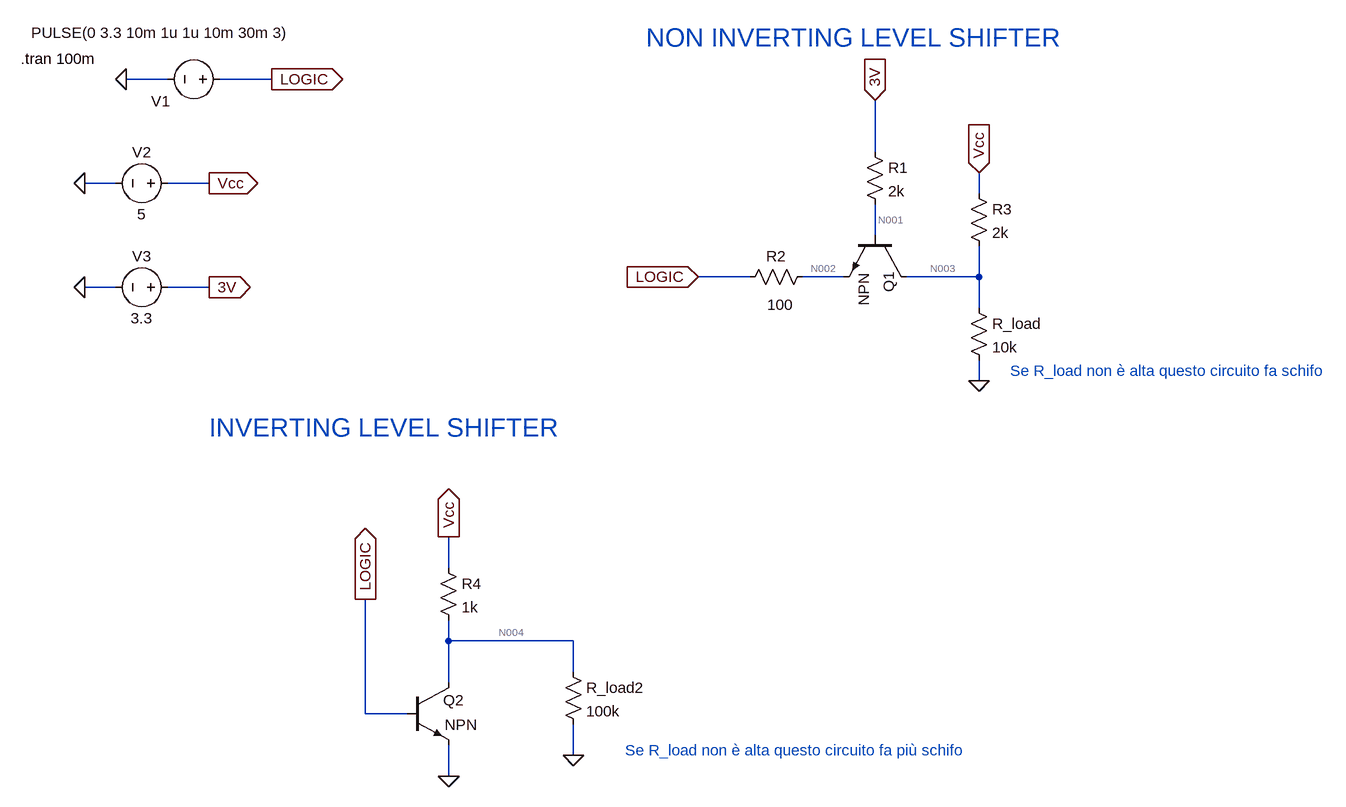
[diagram p0: schematic level_shifter_3.3to5.asc]
level_shifter_3.3to5.asc, the LTspice schematic file:
Version 4
SHEET 1 1340 1076
WIRE -480 -16 -544 -16
WIRE -320 -16 -400 -16
WIRE 608 96 608 16
WIRE -560 144 -608 144
WIRE -416 144 -480 144
WIRE 768 160 768 128
WIRE 608 224 608 176
WIRE 416 288 336 288
WIRE 560 288 496 288
WIRE 768 288 768 240
WIRE 768 288 656 288
WIRE -560 304 -608 304
WIRE -416 304 -480 304
WIRE 768 336 768 288
WIRE 768 448 768 416
WIRE -48 736 -48 688
WIRE -48 848 -48 816
WIRE 144 848 -48 848
WIRE 144 896 144 848
WIRE -48 912 -48 848
WIRE -176 960 -176 784
WIRE -112 960 -176 960
WIRE 144 1024 144 976
WIRE -48 1056 -48 1008
FLAG -544 -16 0
FLAG -608 144 0
FLAG -608 304 0
FLAG 768 448 0
FLAG -416 144 Vcc
IOPIN -416 144 Out
FLAG -416 304 3V
IOPIN -416 304 Out
FLAG -320 -16 LOGIC
IOPIN -320 -16 Out
FLAG 768 128 Vcc
IOPIN 768 128 In
FLAG 608 16 3V
IOPIN 608 16 In
FLAG 336 288 LOGIC
IOPIN 336 288 In
FLAG -48 1056 0
FLAG -176 784 LOGIC
IOPIN -176 784 Out
FLAG -48 688 Vcc
IOPIN -48 688 Out
FLAG 144 1024 0
SYMBOL res 592 80 R0
SYMATTR InstName R1
SYMATTR Value 2k
SYMBOL npn 656 224 R90
WINDOW 0 56 27 Left 2
WINDOW 3 58 65 Left 2
SYMATTR InstName Q1
SYMBOL voltage -384 -16 R90
WINDOW 0 34 92 VRight 2
WINDOW 3 -72 -92 VRight 2
WINDOW 123 0 0 Left 0
WINDOW 39 0 0 Left 0
SYMATTR InstName V1
SYMATTR Value PULSE(0 3.3 10m 1u 1u 10m 30m 3)
SYMBOL voltage -464 144 R90
WINDOW 0 -32 56 VBottom 2
WINDOW 3 32 56 VTop 2
WINDOW 123 0 0 Left 0
WINDOW 39 0 0 Left 0
SYMATTR InstName V2
SYMATTR Value 5
SYMBOL res 752 144 R0
SYMATTR InstName R3
SYMATTR Value 2k
SYMBOL res 752 320 R0
SYMATTR InstName R_load
SYMATTR Value 10k
SYMBOL res 512 272 R90
WINDOW 0 0 56 VBottom 2
WINDOW 3 43 50 VTop 2
SYMATTR InstName R2
SYMATTR Value 100
SYMBOL voltage -464 304 R90
WINDOW 0 -32 56 VBottom 2
WINDOW 3 32 56 VTop 2
WINDOW 123 0 0 Left 0
WINDOW 39 0 0 Left 0
SYMATTR InstName V3
SYMATTR Value 3.3
SYMBOL npn -112 912 R0
WINDOW 0 56 27 Left 2
WINDOW 3 58 65 Left 2
SYMATTR InstName Q2
SYMBOL res -64 720 R0
SYMATTR InstName R4
SYMATTR Value 1k
SYMBOL res 128 880 R0
SYMATTR InstName R_load2
SYMATTR Value 100k
TEXT -590 -48 Right 2 !.tran 100m
TEXT 816 432 Left 2 ;Se R_load non è alta questo circuito fa schifo
TEXT 256 -80 Left 4 ;NON INVERTING LEVEL SHIFTER
TEXT -416 520 Left 4 ;INVERTING LEVEL SHIFTER
TEXT 224 1016 Left 2 ;Se R_load non è alta questo circuito fa più schifo

The netlist it stands for:
* level_shifter_3.3to5.asc
R1 3V N001 2k
Q1 N003 N001 N002 0 NPN
V1 LOGIC 0 PULSE(0 3.3 10m 1u 1u 10m 30m 3)
V2 Vcc 0 5
R3 Vcc N003 2k
R_load N003 0 10k
R2 N002 LOGIC 100
V3 3V 0 3.3
Q2 N004 LOGIC 0 0 NPN
R4 Vcc N004 1k
R_load2 N004 0 100k
.model NPN NPN
.model PNP PNP
.lib standard.bjt
.tran 100m
* Se R_load non è alta questo circuito fa schifo
* NON INVERTING LEVEL SHIFTER
* INVERTING LEVEL SHIFTER
* Se R_load non è alta questo circuito fa più schifo
.backanno
.end

* Results of the author's LTspice run, read from the files saved beside the schematic
* Operating Point, zero values left out:
*   V(3v) = 3.3 V
*   V(n001) = 1.147 V
*   V(n003) = 372.4 mV
*   V(n002) = 335.3 mV
*   V(vcc) = 5 V
*   V(n004) = 4.95 V
*   Ic(Q2) = 4.951 pA
*   Ib(Q2) = -4.951 pA
*   Ic(Q1) = 2.277 mA
*   Ib(Q1) = 1.076 mA
*   Ie(Q1) = -3.353 mA
*   I(R_load2) = 49.5 µA
*   I(R4) = 49.5 µA
*   I(R2) = 3.353 mA
*   I(R_load) = 37.24 µA
*   I(R3) = 2.314 mA
*   I(R1) = 1.076 mA
*   I(V3) = -1.076 mA
*   I(V2) = -2.363 mA
*   I(V1) = 3.353 mA
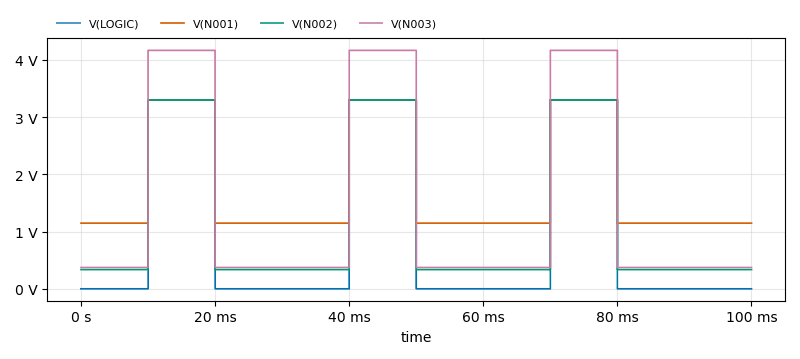
[diagram p1: Transient Analysis of level_shifter_3.3to5.asc, plotted from the saved traces]
* Transient Analysis, 1 run:
*   V(LOGIC): min 0 V, max 3.3 V, average 990.1 mV, rms 1.808 V, last 0 V
*   V(N001): min 1.147 V, max 3.3 V, average 1.793 V, rms 2.047 V, last 1.147 V
*   V(N002): min 335.3 mV, max 3.3 V, average 1.225 V, rms 1.829 V, last 335.3 mV
*   V(N003): min 372.4 mV, max 4.167 V, average 1.511 V, rms 2.303 V, last 372.4 mV